# EAGLE schematic source_eagle (EAGLE 9.6.2)
COMPANY: ADAFRUIT INDUSTRIES; DRAWN: KTOWN; REV: B
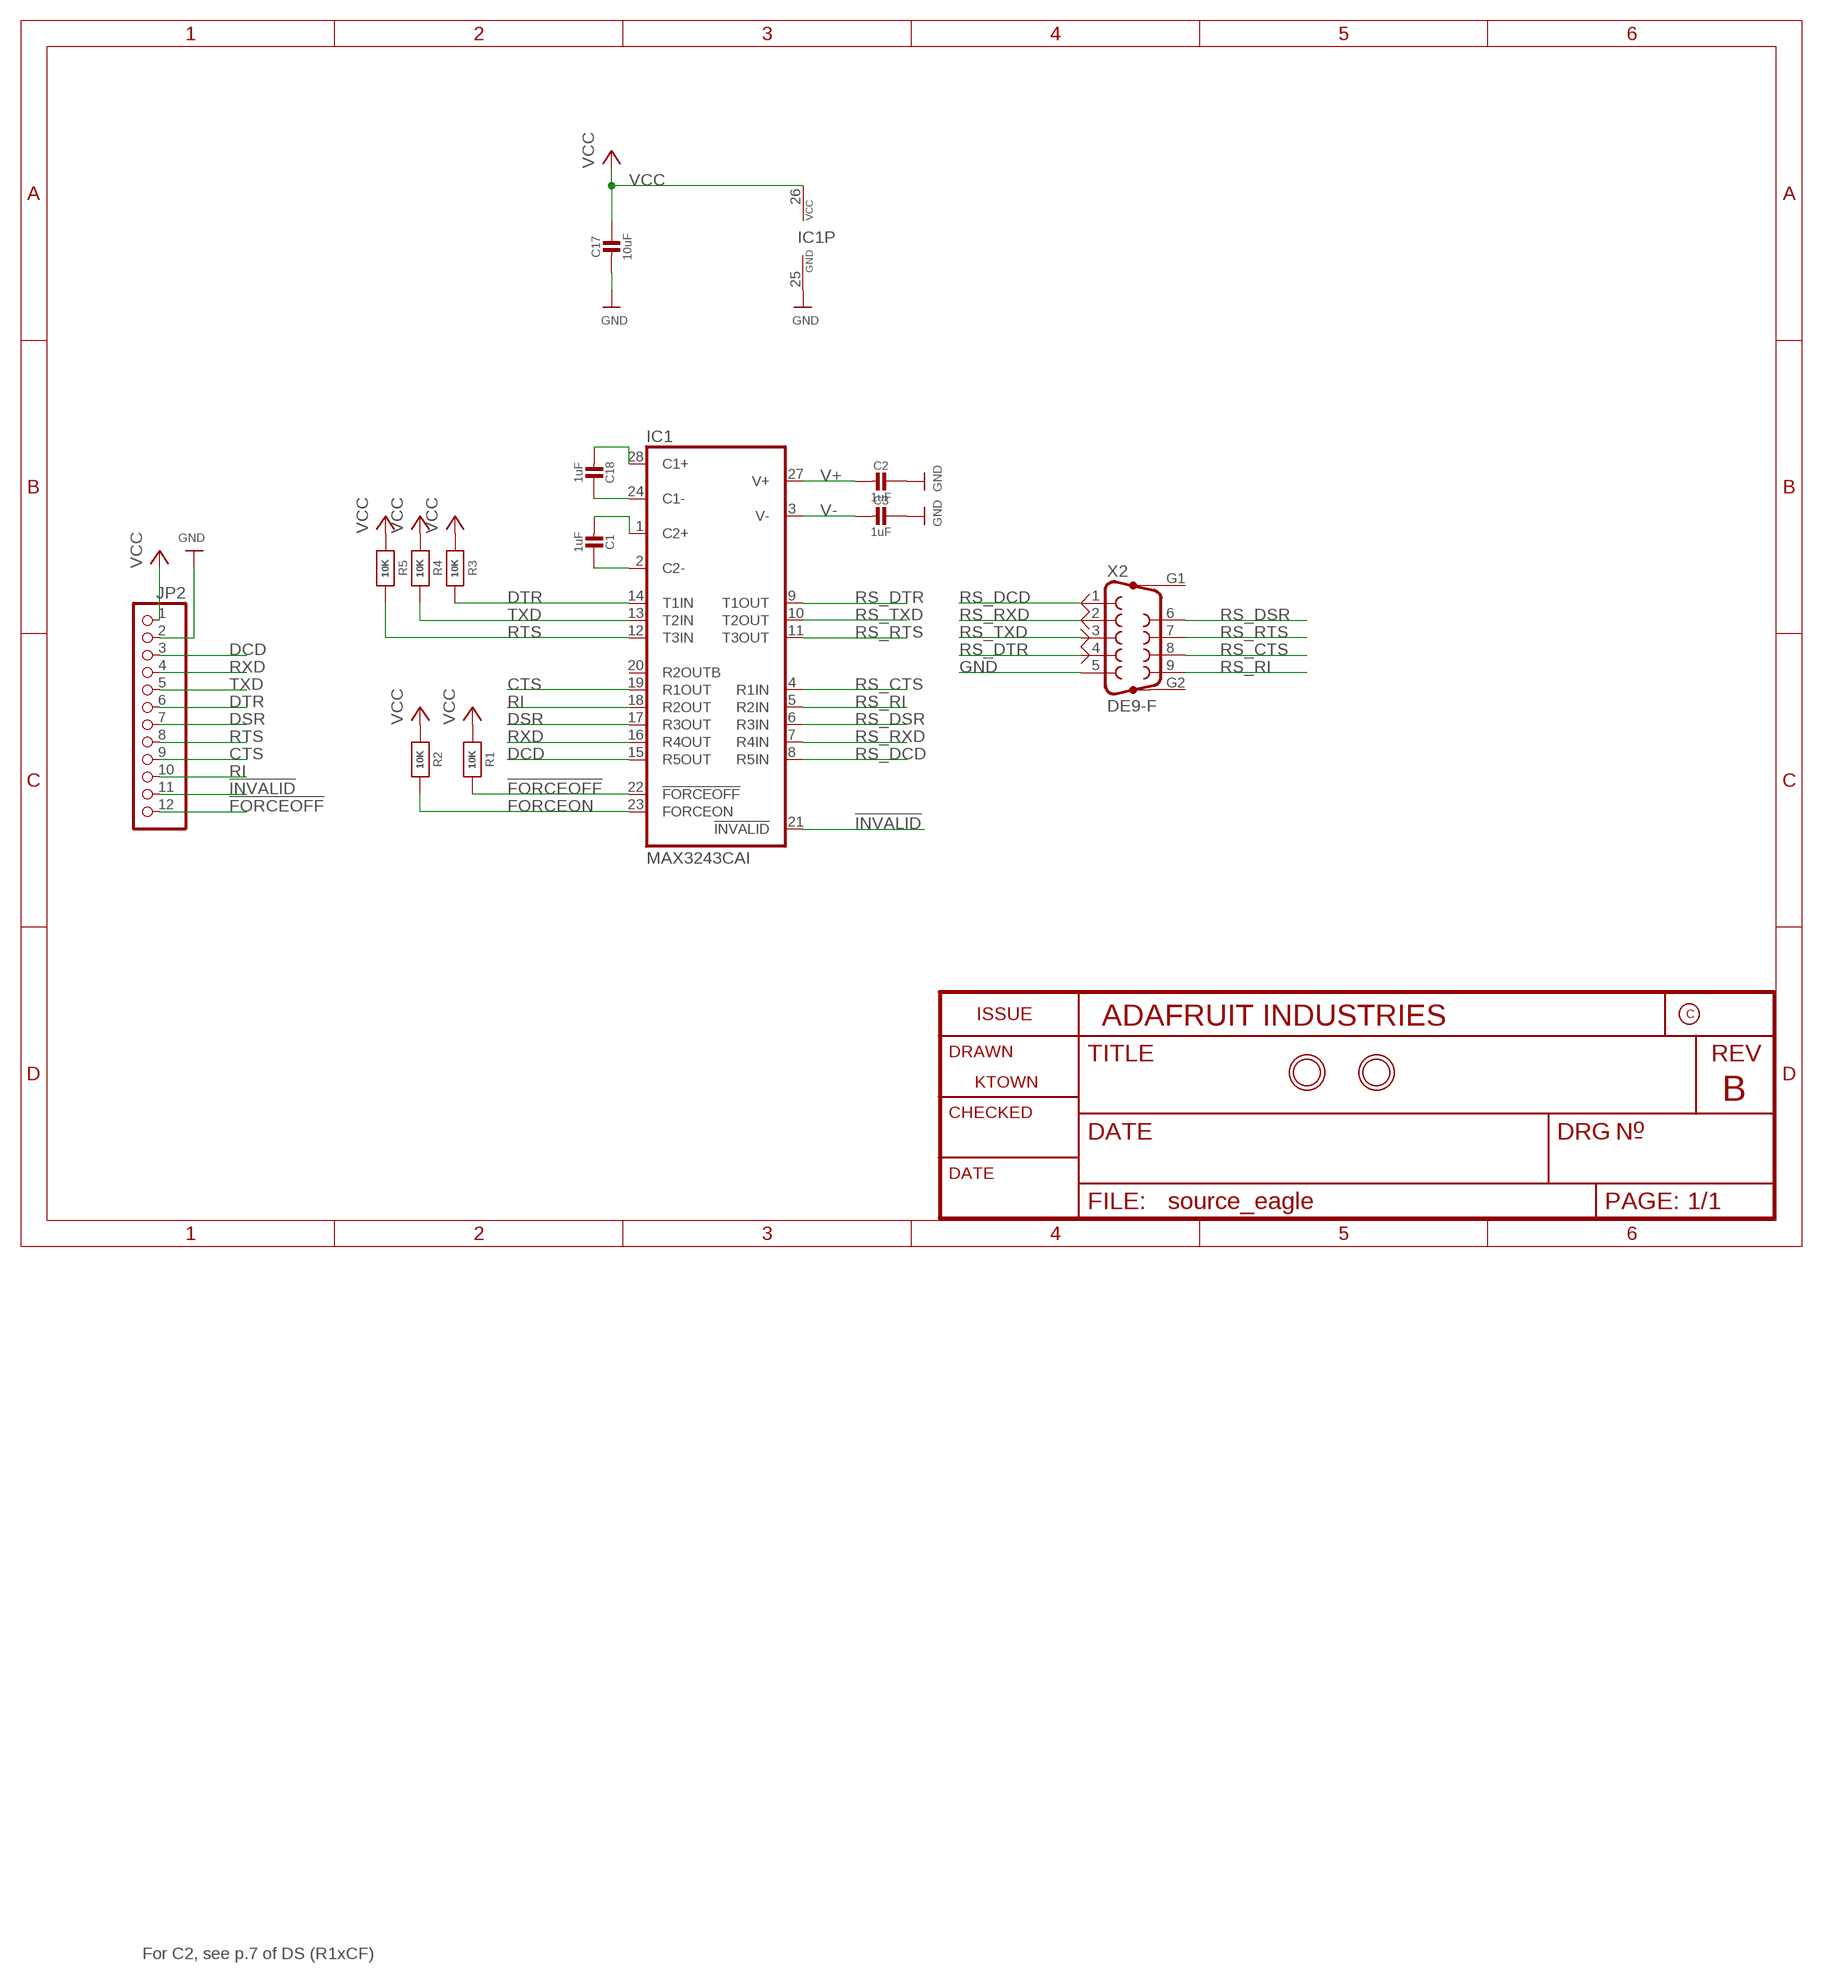
[diagram p0: schematic, sheet 1]

## Parts
C1  1uF  CAP_CERAMIC0603_NO  [0603-NO]
C2  1uF  CAP_CERAMIC0603_NO  [0603-NO]
C3  1uF  CAP_CERAMIC0603_NO  [0603-NO]
C17  10uF  CAP_CERAMIC0805-NOOUTLINE  [0805-NO]
C18  1uF  CAP_CERAMIC0603_NO  [0603-NO]
IC1  MAX3243CAI  [SSOP28]
JP2  HEADER-1X1276MIL  [1X12_ROUND_76MIL]
R1  10K  RESISTOR_0603_NOOUT  [0603-NO]
R2  10K  RESISTOR_0603_NOOUT  [0603-NO]
R3  10K  RESISTOR_0603_NOOUT  [0603-NO]
R4  10K  RESISTOR_0603_NOOUT  [0603-NO]
R5  10K  RESISTOR_0603_NOOUT  [0603-NO]
U$2  MOUNTINGHOLE3.0THIN  [MOUNTINGHOLE_3.0_PLATEDTHIN]
U$3  MOUNTINGHOLE3.0THIN  [MOUNTINGHOLE_3.0_PLATEDTHIN]
X2  DE9-F  F09HP  [F09HP]

## Nets
!FORCEOFF: IC1.22(!FORCEOFF) JP2.12 R1.2
!INVALID: IC1.21(!INVALID) JP2.11
CTS: IC1.19(R1OUT) JP2.9
DCD: IC1.15(R5OUT) JP2.3
DSR: IC1.17(R3OUT) JP2.7
DTR: IC1.14(T1IN) JP2.6 R3.2
FORCEON: IC1.23(FORCEON) R2.2
GND [gnd]: C2.1 C3.1 C17.2 IC1.25(GND) JP2.2 X2.5
N$1: C18.2 IC1.28(C1+)
N$2: C18.1 IC1.24(C1-)
N$3: C1.1 IC1.2(C2-)
N$4: C1.2 IC1.1(C2+)
RI: IC1.18(R2OUT) JP2.10
RS_CTS: IC1.4(R1IN) X2.8
RS_DCD: IC1.8(R5IN) X2.1
RS_DSR: IC1.6(R3IN) X2.6
RS_DTR: IC1.9(T1OUT) X2.4
RS_RI: IC1.5(R2IN) X2.9
RS_RTS: IC1.11(T3OUT) X2.7
RS_RXD: IC1.7(R4IN) X2.2
RS_TXD: IC1.10(T2OUT) X2.3
RTS: IC1.12(T3IN) JP2.8 R5.2
RXD: IC1.16(R4OUT) JP2.4
TXD: IC1.13(T2IN) JP2.5 R4.2
V+: C2.2 IC1.27(V+)
V-: C3.2 IC1.3(V-)
VCC: C17.1 IC1.26(VCC) JP2.1 R1.1 R2.1 R3.1 R4.1 R5.1
Unconnected: IC1.20(R2OUTB) X2.G1 X2.G2

## Notes on the sheet
- For C2, see p.7 of DS (R1xCF)

## Library data of the parts
C1-C3 C17 C18 = microbuilder:CAP_CERAMIC: Ceramic Capacitors For new designs, use the packages preceded by an '_' character since they are more reliable: The following footprints should be used on most boards: _0402 - Standard footprint for regular board layouts _0603 - Standard footprint for regular board layouts _0805 - Standard footprint for regular board layouts _1206 - Standard footprint for regular board layouts For extremely tight-pitch boards where space is at a premium, the following 'micro-pitch' footprints can be used (smaller pads, no silkscreen outline, etc.): _0402MP - Micro-pitch footprint for very dense/compact boards _0603MP - Micro-pitch footprint for very dense/compact boards _0805MP - Micro-pitch footprint for very dense/compact boards _1206MP - Micro-pitch footprint for very dense/compact boards
IC1 = maxim:MAX3243*: RS-232 Transceivers with AutoShutdown 1µA Supply-Current, True +3V to +5.5V http://dbserv.maxim-ic.com/; MF: MAXIM; MPN: MAX3243CAI+; OC_FARNELL: 1379933; OC_NEWARK: 59K9409
JP2 = microbuilder:HEADER-1X12
R1-R5 = microbuilder:RESISTOR: Resistors For new designs, use the packages preceded by an '_' character since they are more reliable: The following footprints should be used on most boards: _0402 - Standard footprint for regular board layouts _0603 - Standard footprint for regular board layouts _0805 - Standard footprint for regular board layouts _1206 - Standard footprint for regular board layouts For extremely tight-pitch boards where space is at a premium, the following 'micro-pitch' footprints can be used (smaller pads, no silkscreen outline, etc.): _0402MP - Micro-pitch footprint for very dense/compact boards _0603MP - Micro-pitch footprint for very dense/compact boards _0805MP - Micro-pitch footprint for very dense/compact boards _1206MP - Micro-pitch footprint for very dense/compact boards
U$2 U$3 = microbuilder:MOUNTINGHOLE: Mounting Hole For #2 screws (0.086"/2.18mm width, 0.094"/2.4mm hole) use 2.5mm; BOM: EXCLUDE
X2 = adafruit_electromech:F09HP: SUB-D; OC_FARNELL: unknown; OC_NEWARK: unknown

## Net classes
1 power: width 0.254 mm
2 gnd: width 0.254 mm